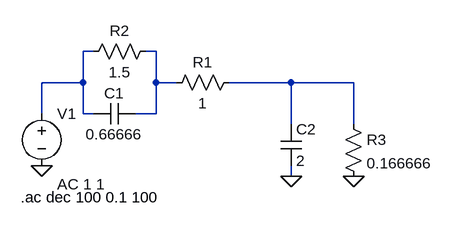
[diagram p0: schematic Pt2.asc]
Pt2.asc, the LTspice schematic file:
Version 4
SHEET 1 880 680
WIRE 0 64 -16 64
WIRE 96 64 80 64
WIRE -16 112 -16 64
WIRE -16 112 -80 112
WIRE 96 112 96 64
WIRE 128 112 96 112
WIRE 304 112 208 112
WIRE 400 112 304 112
WIRE -80 160 -80 112
WIRE -16 160 -16 112
WIRE 0 160 -16 160
WIRE 96 160 96 112
WIRE 96 160 64 160
WIRE 304 176 304 112
WIRE 400 176 400 112
WIRE 304 256 304 240
FLAG -80 240 0
FLAG 304 256 0
FLAG 400 256 0
SYMBOL res 96 48 R90
WINDOW 0 0 56 VBottom 2
WINDOW 3 32 56 VTop 2
SYMATTR InstName R2
SYMATTR Value 1.5
SYMBOL cap 64 144 R90
WINDOW 0 0 32 VBottom 2
WINDOW 3 32 32 VTop 2
SYMATTR InstName C1
SYMATTR Value 0.66666
SYMBOL voltage -80 144 R0
WINDOW 123 24 124 Left 2
WINDOW 39 0 0 Left 0
SYMATTR Value2 AC 1 1
SYMATTR InstName V1
SYMATTR Value ""
SYMBOL res 224 96 R90
WINDOW 0 0 56 VBottom 2
WINDOW 3 32 56 VTop 2
SYMATTR InstName R1
SYMATTR Value 1
SYMBOL cap 288 176 R0
SYMATTR InstName C2
SYMATTR Value 2
SYMBOL res 384 160 R0
SYMATTR InstName R3
SYMATTR Value 0.166666
TEXT -112 288 Left 2 !.ac dec 100 0.1 100

The netlist it stands for:
* Pt2.asc
R2 N002 N001 1.5
C1 N002 N001 0.66666
V1 N001 0 AC 1 1
R1 N003 N002 1
C2 N003 0 2
R3 N003 0 0.166666
.ac dec 100 0.1 100
.backanno
.end